# EAGLE design untitled (EAGLE 9.6.2)
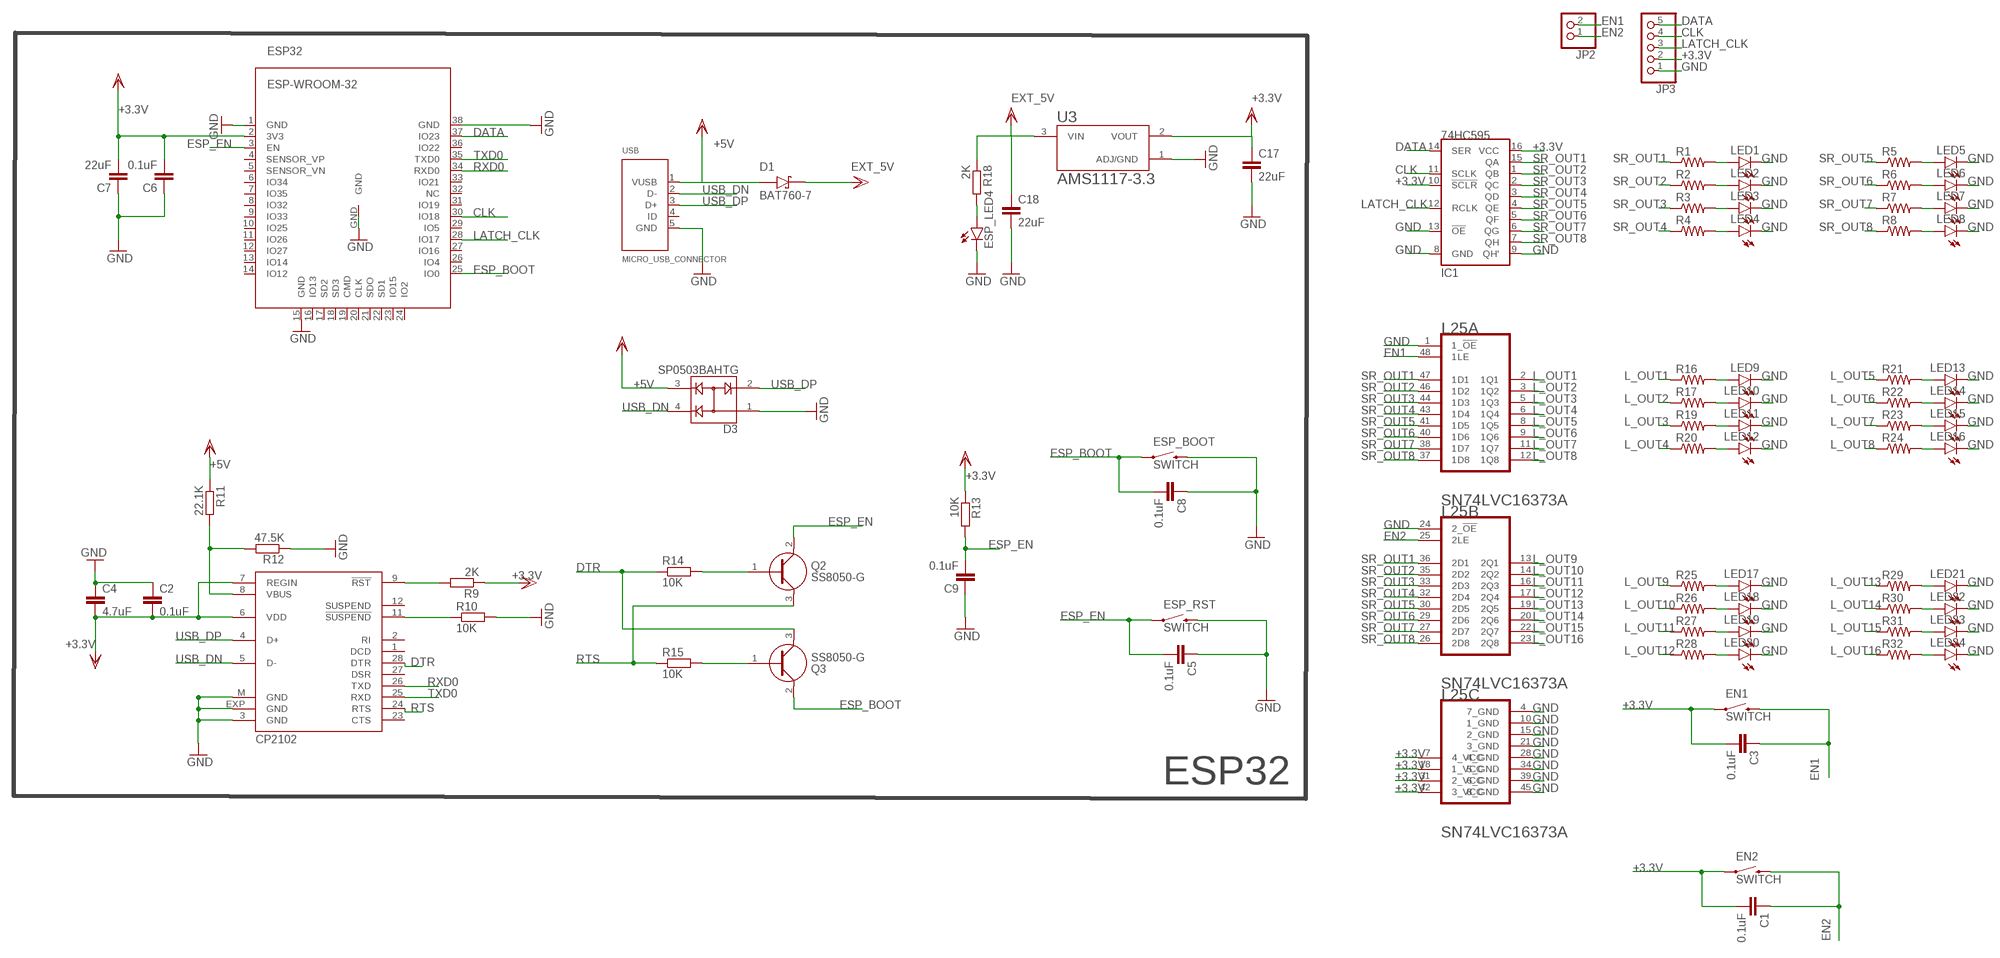
[diagram p0: schematic, sheet 1]

## Parts
C1  0.1uF  C-EUC0805  [C0805]
C2  0.1uF  C-EUC0805  [C0805]
C3  0.1uF  C-EUC0805  [C0805]
C4  4.7uF  C-EUC0805  [C0805]
C5  0.1uF  C-EUC0805  [C0805]
C6  0.1uF  C-EUC0805  [C0805]
C7  22uF  C-EUC0805  [C0805]
C8  0.1uF  C-EUC0805  [C0805]
C9  0.1uF  C-EUC0805  [C0805]
C17  22uF  C-EUC0805  [C0805]
C18  22uF  C-EUC0805  [C0805]
D1  BAT760-7  [SOD2513X120N]
D3  SP0503BAHTG  [SOT143]
EN1  SWITCH  [SWITCH_2PIN]
EN2  SWITCH  [SWITCH_2PIN]
ESP32  ESP-WROOM-32  [ESP-WROOM-32]
ESP_BOOT  SWITCH  [SWITCH_2PIN]
ESP_LED4  LEDCHIPLED_0805  [CHIPLED_0805]
ESP_RST  SWITCH  [SWITCH_2PIN]
IC1  74HC595  [SO16]
IC3  CP2102  [MLP28]
JP2  PINHD-1X2  [1X02]
JP3  PINHD-1X5  [1X05]
L25  TEXAS_INSTRUMENTS_SN74LVC16373ATEXAS_INSTRUMENTS_SN74LVC16373A_0_2  [TEXAS_INSTRUMENTS_SN74LVC16373A_2]
LED1  LEDCHIPLED_0805  [CHIPLED_0805]
LED2  LEDCHIPLED_0805  [CHIPLED_0805]
LED3  LEDCHIPLED_0805  [CHIPLED_0805]
LED4  LEDCHIPLED_0805  [CHIPLED_0805]
LED5  LEDCHIPLED_0805  [CHIPLED_0805]
LED6  LEDCHIPLED_0805  [CHIPLED_0805]
LED7  LEDCHIPLED_0805  [CHIPLED_0805]
LED8  LEDCHIPLED_0805  [CHIPLED_0805]
LED9  LEDCHIPLED_0805  [CHIPLED_0805]
LED10  LEDCHIPLED_0805  [CHIPLED_0805]
LED11  LEDCHIPLED_0805  [CHIPLED_0805]
LED12  LEDCHIPLED_0805  [CHIPLED_0805]
LED13  LEDCHIPLED_0805  [CHIPLED_0805]
LED14  LEDCHIPLED_0805  [CHIPLED_0805]
LED15  LEDCHIPLED_0805  [CHIPLED_0805]
LED16  LEDCHIPLED_0805  [CHIPLED_0805]
LED17  LEDCHIPLED_0805  [CHIPLED_0805]
LED18  LEDCHIPLED_0805  [CHIPLED_0805]
LED19  LEDCHIPLED_0805  [CHIPLED_0805]
LED20  LEDCHIPLED_0805  [CHIPLED_0805]
LED21  LEDCHIPLED_0805  [CHIPLED_0805]
LED22  LEDCHIPLED_0805  [CHIPLED_0805]
LED23  LEDCHIPLED_0805  [CHIPLED_0805]
LED24  LEDCHIPLED_0805  [CHIPLED_0805]
Q2  SS8050-G  [MBTB-T-SOT23]
Q3  SS8050-G  [MBTB-T-SOT23]
R1  R-US_R0805  [R0805]
R2  R-US_R0805  [R0805]
R3  R-US_R0805  [R0805]
R4  R-US_R0805  [R0805]
R5  R-US_R0805  [R0805]
R6  R-US_R0805  [R0805]
R7  R-US_R0805  [R0805]
R8  R-US_R0805  [R0805]
R9  2K  R-EU_R0805  [R0805]
R10  10K  R-EU_R0805  [R0805]
R11  22.1K  R-EU_R0805  [R0805]
R12  47.5K  R-EU_R0805  [R0805]
R13  10K  R-EU_R0805  [R0805]
R14  10K  R-EU_R0805  [R0805]
R15  10K  R-EU_R0805  [R0805]
R16  R-US_R0805  [R0805]
R17  R-US_R0805  [R0805]
R18  2K  R-EU_R0805  [R0805]
R19  R-US_R0805  [R0805]
R20  R-US_R0805  [R0805]
R21  R-US_R0805  [R0805]
R22  R-US_R0805  [R0805]
R23  R-US_R0805  [R0805]
R24  R-US_R0805  [R0805]
R25  R-US_R0805  [R0805]
R26  R-US_R0805  [R0805]
R27  R-US_R0805  [R0805]
R28  R-US_R0805  [R0805]
R29  R-US_R0805  [R0805]
R30  R-US_R0805  [R0805]
R31  R-US_R0805  [R0805]
R32  R-US_R0805  [R0805]
U3  AMS1117-3.3  [SOT229P700X180-4N]
USB  MICRO_USB_CONNECTOR  [MICRO_USB_4LEGS]

## Nets
+3.3V: C1.2 C2.2 C3.2 C4.2 C6.2 C7.2 C17.1 EN1.1 EN2.1 ESP32.2(3V3) IC1.10(!SCLR) IC1.16(VCC) IC3.6(VDD) IC3.7(REGIN) JP3.2 L25.7(C:4_VCC) L25.18(C:1_VCC) L25.31(C:2_VCC) L25.42(C:3_VCC) R9.1 R13.1 U3.2(VOUT) ; supply symbol labelled VDD
+5V: D1.A D3.3 R11.1 USB.1(VUSB) ; supply symbol labelled VDD
CLK: ESP32.30(IO18) IC1.11(SCLK) JP3.4
DATA: ESP32.37(IO23) IC1.14(SER) JP3.5
DTR: IC3.28(DTR) Q3.3(C) R14.1
EN1: C3.1 EN1.2 JP2.2 L25.48(A:1LE)
EN2: C1.1 EN2.2 JP2.1 L25.25(B:2LE)
ESP_BOOT: C8.2 ESP32.25(IO0) ESP_BOOT.1 Q3.2(E)
ESP_EN: C5.2 C9.2 ESP32.3(EN) ESP_RST.1 Q2.2(E) R13.2
EXT_5V: C18.1 D1.C(K) R18.1 U3.3(VIN) ; supply symbol labelled VDD
GND: C2.1 C4.1 C5.1 C6.1 C7.1 C8.1 C9.1 C17.2 C18.2 D3.1 ESP32.1(GND) ESP32.15(GND) ESP32.38(GND) ESP32.GND ESP_BOOT.2 ESP_LED4.C ESP_RST.2 IC1.8(GND) IC1.9(QH') IC1.13(!OE) IC3.3(GND) IC3.EXP(GND) IC3.M(GND) JP3.1 L25.1(A:1_!OE!) L25.4(C:7_GND) L25.10(C:1_GND) L25.15(C:2_GND) L25.21(C:3_GND) L25.24(B:2_!OE!) L25.28(C:4_GND) L25.34(C:5_GND) L25.39(C:6_GND) L25.45(C:8_GND) LED1.C LED2.C LED3.C LED4.C LED5.C LED6.C LED7.C LED8.C LED9.C LED10.C LED11.C LED12.C LED13.C LED14.C LED15.C LED16.C LED17.C LED18.C LED19.C LED20.C LED21.C LED22.C LED23.C LED24.C R10.2 R12.1 U3.1(ADJ/GND) USB.5(GND)
L_OUT1: L25.2(A:1Q1) R16.1
L_OUT2: L25.3(A:1Q2) R17.1
L_OUT3: L25.5(A:1Q3) R19.1
L_OUT4: L25.6(A:1Q4) R20.1
L_OUT5: L25.8(A:1Q5) R21.1
L_OUT6: L25.9(A:1Q6) R22.1
L_OUT7: L25.11(A:1Q7) R23.1
L_OUT8: L25.12(A:1Q8) R24.1
L_OUT9: L25.13(B:2Q1) R25.1
L_OUT10: L25.14(B:2Q2) R26.1
L_OUT11: L25.16(B:2Q3) R27.1
L_OUT12: L25.17(B:2Q4) R28.1
L_OUT13: L25.19(B:2Q5) R29.1
L_OUT14: L25.20(B:2Q6) R30.1
L_OUT15: L25.22(B:2Q7) R31.1
L_OUT16: L25.23(B:2Q8) R32.1
LATCH_CLK: ESP32.28(IO17) IC1.12(RCLK) JP3.3
N$1: LED1.A R1.2
N$2: LED2.A R2.2
N$3: LED3.A R3.2
N$4: LED4.A R4.2
N$5: LED5.A R5.2
N$6: LED6.A R6.2
N$7: IC3.11(!SUSPEND) R10.1
N$8: IC3.8(VBUS) R11.2 R12.2
N$9: Q2.1(B) R14.2
N$10: Q3.1(B) R15.2
N$11: LED7.A R7.2
N$12: LED8.A R8.2
N$13: ESP_LED4.A R18.2
N$14: LED9.A R16.2
N$15: LED10.A R17.2
N$16: LED11.A R19.2
N$17: LED12.A R20.2
N$18: LED13.A R21.2
N$19: IC3.9(!RST) R9.2
N$20: LED14.A R22.2
N$21: LED15.A R23.2
N$22: LED16.A R24.2
N$23: LED17.A R25.2
N$24: LED18.A R26.2
N$25: LED19.A R27.2
N$26: LED20.A R28.2
N$27: LED21.A R29.2
N$28: LED22.A R30.2
N$29: LED23.A R31.2
N$30: LED24.A R32.2
RTS: IC3.24(RTS) Q2.3(C) R15.1
RXD0: ESP32.34(RXD0) IC3.26(TXD)
SR_OUT1: IC1.15(QA) L25.36(B:2D1) L25.47(A:1D1) R1.1
SR_OUT2: IC1.1(QB) L25.35(B:2D2) L25.46(A:1D2) R2.1
SR_OUT3: IC1.2(QC) L25.33(B:2D3) L25.44(A:1D3) R3.1
SR_OUT4: IC1.3(QD) L25.32(B:2D4) L25.43(A:1D4) R4.1
SR_OUT5: IC1.4(QE) L25.30(B:2D5) L25.41(A:1D5) R5.1
SR_OUT6: IC1.5(QF) L25.29(B:2D6) L25.40(A:1D6) R6.1
SR_OUT7: IC1.6(QG) L25.27(B:2D7) L25.38(A:1D7) R7.1
SR_OUT8: IC1.7(QH) L25.26(B:2D8) L25.37(A:1D8) R8.1
TXD0: ESP32.35(TXD0) IC3.25(RXD)
USB_DN: D3.4 IC3.5(D-) USB.2(D-)
USB_DP: D3.2 IC3.4(D+) USB.3(D+)
Unconnected: ESP32.4(SENSOR_VP) ESP32.5(SENSOR_VN) ESP32.6(IO34) ESP32.7(IO35) ESP32.8(IO32) ESP32.9(IO33) ESP32.10(IO25) ESP32.11(IO26) ESP32.12(IO27) ESP32.13(IO14) ESP32.14(IO12) ESP32.16(IO13) ESP32.17(SD2) ESP32.18(SD3) ESP32.19(CMD) ESP32.20(CLK) ESP32.21(SDO) ESP32.22(SD1) ESP32.23(IO15) ESP32.24(IO2) ESP32.26(IO4) ESP32.27(IO16) ESP32.29(IO5) ESP32.31(IO19) ESP32.32(NC) ESP32.33(IO21) ESP32.36(IO22) IC3.1(DCD) IC3.2(RI) IC3.12(SUSPEND) IC3.23(CTS) IC3.27(DSR) USB.4(ID)

## Notes on the sheet
- ESP32

## Library data of the parts
C1-C9 C17 C18 = rcl:C-EU: CAPACITOR, European symbol
D1 = BAT760-7:BAT760-7: Diode Schottky 30V 1A Surface Mount SOD-323 Check prices <https://pricing.snapeda.com/parts/BAT760-7/Diodes%20Zetex/view-part?ref=eda>; AVAILABILITY: In Stock; DESCRIPTION: Diode Schottky 30V 1A 2-Pin SOD-323 T/R; MF: Diodes Zetex; MP: BAT760-7; PACKAGE: None; PRICE: None
D3 = SP0503BAHTG:SP0503BAHTG: TVS DIODE 5.5VWM 8.5VC SOT143 Check prices <https://pricing.snapeda.com/parts/SP0503BAHTG/Littelfuse%20Inc./view-part?ref=eda>; AVAILABILITY: In Stock; DESCRIPTION: 8.5V Clamp Ipp Tvs Diode Surface Mount SOT-143-4; MF: Littelfuse Inc.; MP: SP0503BAHTG; PACKAGE: SOT-143 Littelfuse; PRICE: None; PURCHASE-URL: https://pricing.snapeda.com/search/part/SP0503BAHTG/?ref=eda
EN1 EN2 ESP_BOOT ESP_RST = all_in_one:SWITCH
ESP32 = esp32:ESP-WROOM-32
ESP_LED4 LED1-LED24 = led:LED: LED OSRAM: - CHIPLED LG R971, LG N971, LY N971, LG Q971, LY Q971, LO R971, LY R971 LH N974, LH R974 LS Q976, LO Q976, LY Q976 LO Q996 - Hyper CHIPLED LW Q18S LB Q993, LB Q99A, LB R99A - SideLED LS A670, LO A670, LY A670, LG A670, LP A670 LB A673, LV A673, LT A673, LW A673 LH A674 LY A675 LS A676, LA A676, LO A676, LY A676, LW A676 LS A679, LY A679, LG A679 - Hyper Micro SIDELED® LS Y876, LA Y876, LO Y876, LY Y876 LT Y87S - SmartLED LW L88C, LW L88S LB L89C, LB L89S, LG L890 LS L89K, LO L89K, LY L89K LS L896, LA L896, LO L896, LY L896 - TOPLED LS T670, LO T670, LY T670, LG T670, LP T670 LSG T670, LSP T670, LSY T670, LOP T670, LYG T670 LG T671, LOG T671, LSG T671 LB T673, LV T673, LT T673, LW T673 LH T674 LS T676, LA T676, LO T676, LY T676, LB T676, LH T676, LSB T676, LW T676 LB T67C, LV T67C, LT T67C, LS T67K, LO T67K, LY T67K, LW E67C LS E67B, LA E67B, LO E67B, LY E67B, LB E67C, LV E67C, LT E67C LW T67C LS T679, LY T679, LG T679 LS T770, LO T770, LY T770, LG T770, LP T770 LB T773, LV T773, LT T773, LW T773 LH T774 LS E675, LA E675, LY E675, LS T675 LS T776, LA T776, LO T776, LY T776, LB T776 LHGB T686 LT T68C, LB T68C - Hyper Mini TOPLED® LB M676 - Mini TOPLED Santana® LG M470 LS M47K, LO M47K, LY M47K Source: http://www.osram.convergy.de LUXEON: - LUMILED® LXK2-PW12-R00, LXK2-PW12-S00, LXK2-PW14-U00, LXK2-PW14-V00 LXK2-PM12-R00, LXK2-PM12-S00, LXK2-PM14-U00 LXK2-PE12-Q00, LXK2-PE12-R00, LXK2-PE12-S00, LXK2-PE14-T00, LXK2-PE14-U00 LXK2-PB12-K00, LXK2-PB12-L00, LXK2-PB12-M00, LXK2-PB14-N00, LXK2-PB14-P00, LXK2-PB14-Q00 LXK2-PR12-L00, LXK2-PR12-M00, LXK2-PR14-Q00, LXK2-PR14-R00 LXK2-PD12-Q00, LXK2-PD12-R00, LXK2-PD12-S00 LXK2-PH12-R00, LXK2-PH12-S00 LXK2-PL12-P00, LXK2-PL12-Q00, LXK2-PL12-R00 Source: www.luxeon.com KINGBRIGHT: KA-3528ASYC Source: www.kingbright.com
IC1 = 74HC595:74HC595: 8-bit SHIFT REGISTER, output latch Check availability <https://pricing.snapeda.com/parts/74HC595/Nexperia/view-part?ref=eda>; AVAILABILITY: In Stock; CHECK_PRICES: https://www.snapeda.com/parts/74HC595/Nexperia/view-part/?ref=eda; DESCRIPTION: Shift Register Single 8-Bit Serial to Serial/Parallel 16-Pin SSOP T/R; MF: Nexperia; MP: 74HC595; PACKAGE: None; PRICE: None; SNAPEDA_LINK: https://www.snapeda.com/parts/74HC595/Nexperia/view-part/?ref=snap
IC3 = silabs:CP210*: Single-Chip USB to UART Bridge Source: www.silabs.com .. CP2101.pdf / cp2102.pdf; MF: FARNELL; MPN: CP2102-GM; OC_FARNELL: 9282130; OC_NEWARK: 30K5635
JP2 = pinhead:PINHD-1X2: PIN HEADER
JP3 = pinhead:PINHD-1X5: PIN HEADER
L25 = SN74LVC16373A(NEW_16BIT_LATCH):TEXAS_INSTRUMENTS_SN74LVC16373A: TI-SN54_74XXXXX16X373X-48; 3_STATE_OUTPUT: Yes; BITS: 16; CIIVA_IDS: 19307467; CODE__JEDEC: MO-153; DATASHEET_VERSION: SCAS755B; FOOTPRINT_VARIANT_NAME_0: Level C; FOOTPRINT_VARIANT_NAME_1: Level B; FOOTPRINT_VARIANT_NAME_2: Level A; F__NOM_VOLTAGEMAXMHZ: 100; ICC__NOM_VOLTAGEMAXMA: 0.02; IMPORTED: yes; IMPORTED_FROM: vault; IMPORT_TS: 1521844253; INPUT_TYPE: CMOS,TTL; LOGIC: true; MF: Texas Instruments; MPN: SN74LVC16373A; OPERATING_TEMPERATURE_RANGEC: -40 to 125,-40 to 85; OUTPUT_DRIVE_IOLIOHMAXMA: 24/-24; OUTPUT_LOGIC: Non-inverted; OUTPUT_TYPE: CMOS; PACKAGE: DGG0048A; PREFIX: U; RATING: Catalog; RELEASE_DATE: 1459328133; SCHMITT_TRIGGER: No; STATIC_CURRENT: 0.02; TECHNOLOGY_FAMILY: LVC; TPD__NOM_VOLTAGEMAXNS: 6.4,4.2,4.9; VAULT_GUID: 00FB3570-8383-4C82-A038-A58A20934C8C; VAULT_REVISION: B0EE8CD6-9ACA-4FFF-ACFC-C0240CF4C59E; VCC_MAX_V: 3.6; VCC_MIN_V: 1.65; VOLTAGE_NOM_V: 1.8,2.5,2.7,3.3
Q2 Q3 = SS8050-G:SS8050-G: Bipolar Transistors - BJT NPN TRANSISTOR 1.5A 40V Source: Datasheet <https://componentsearchengine.com/Datasheets/1/SS8050-G.pdf> Check prices <https://pricing.snapeda.com/parts/SS8050-G/Comchip%20Technology/view-part?ref=eda>; AVAILABILITY: In Stock; DESCRIPTION: Bipolar (BJT) Transistor NPN 25V 1.5A 100MHz 300mW Surface Mount SOT-23-3; MF: Comchip Technology; MP: SS8050-G; PACKAGE: TO-236 Comchip; PRICE: None; PURCHASE-URL: https://pricing.snapeda.com/search/part/SS8050-G/?ref=eda
R1-R8 R16 R17 R19-R32 = rcl:R-US_: RESISTOR, American symbol; SPICEPREFIX: R
R9-R15 R18 = rcl:R-EU_: RESISTOR, European symbol
U3 = AMS1117-3.3:AMS1117-3.3: Sot223/Pkg 1-Amp 3.3-Volt Low Drop Out Voltage Regulatator Check prices <https://pricing.snapeda.com/parts/AMS1117-3.3/Advanced%20Monolithic%20Systems/view-part?ref=eda>; AVAILABILITY: Not in stock; DESCRIPTION: LDO Voltage Regulators 800MA LDO LINEAR REG; MF: Advanced Monolithic Systems; MP: AMS1117-3.3; PACKAGE: SOT-89 ams; PRICE: None
USB = all_in_one1:MICRO_USB_CONNECTOR

## Board
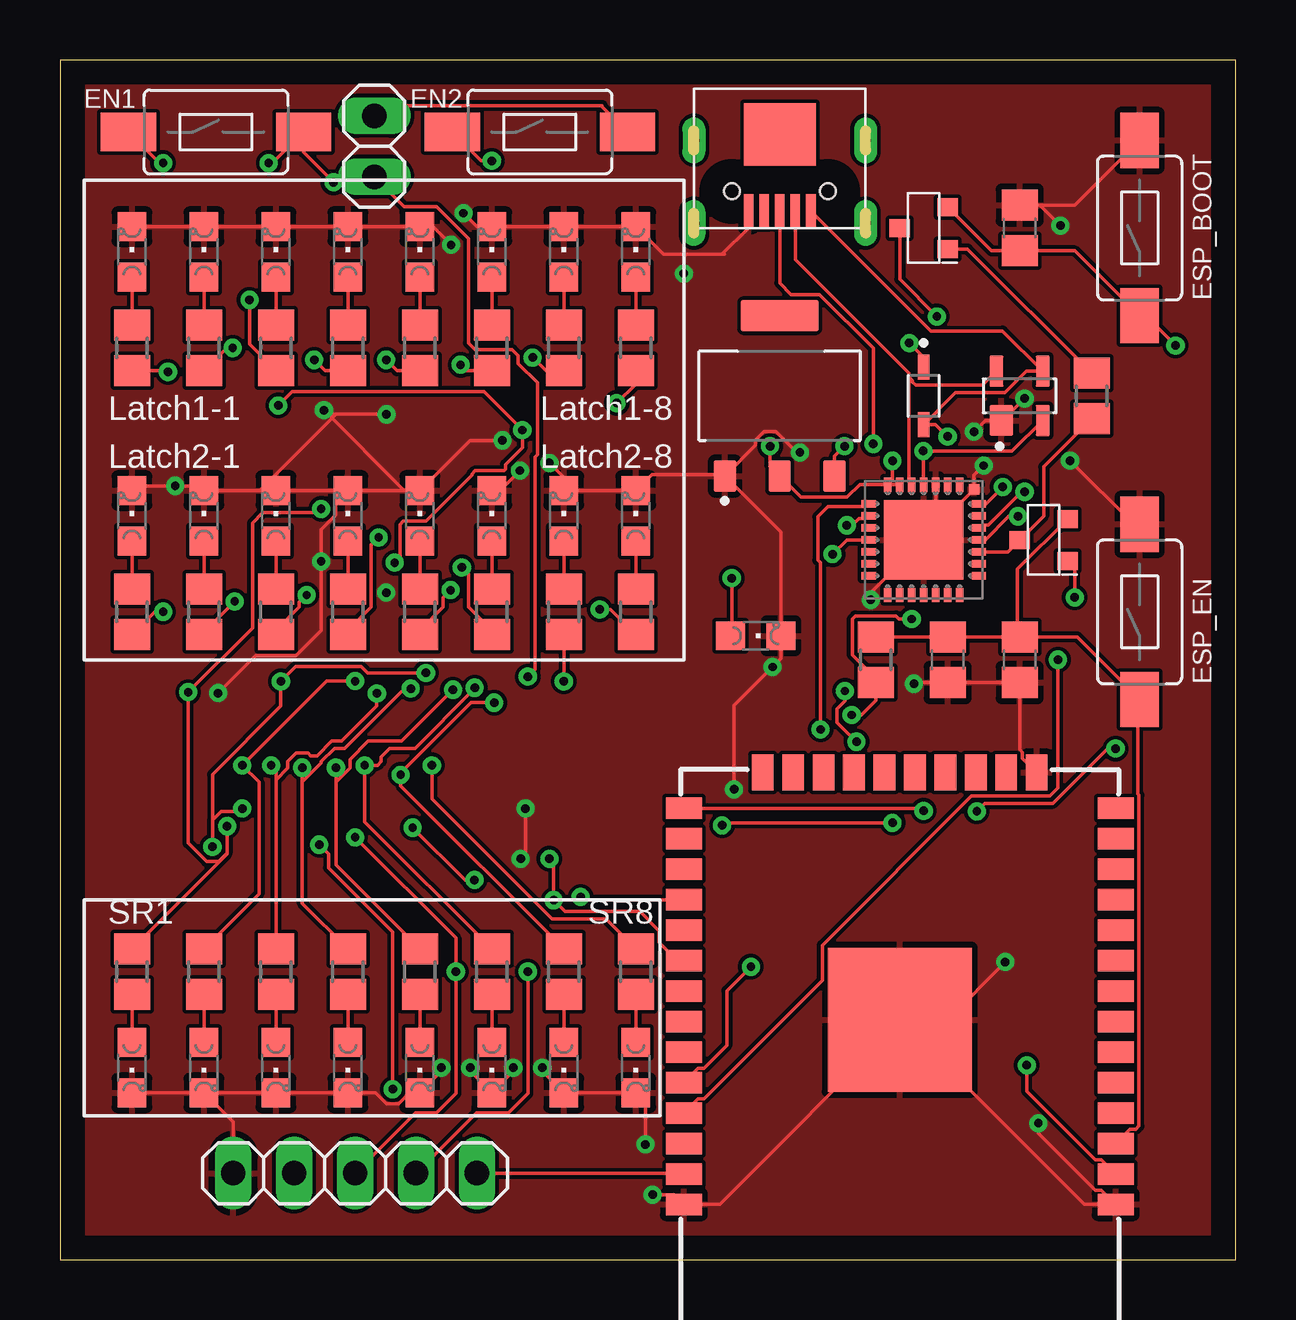
[diagram p1: board, top side]
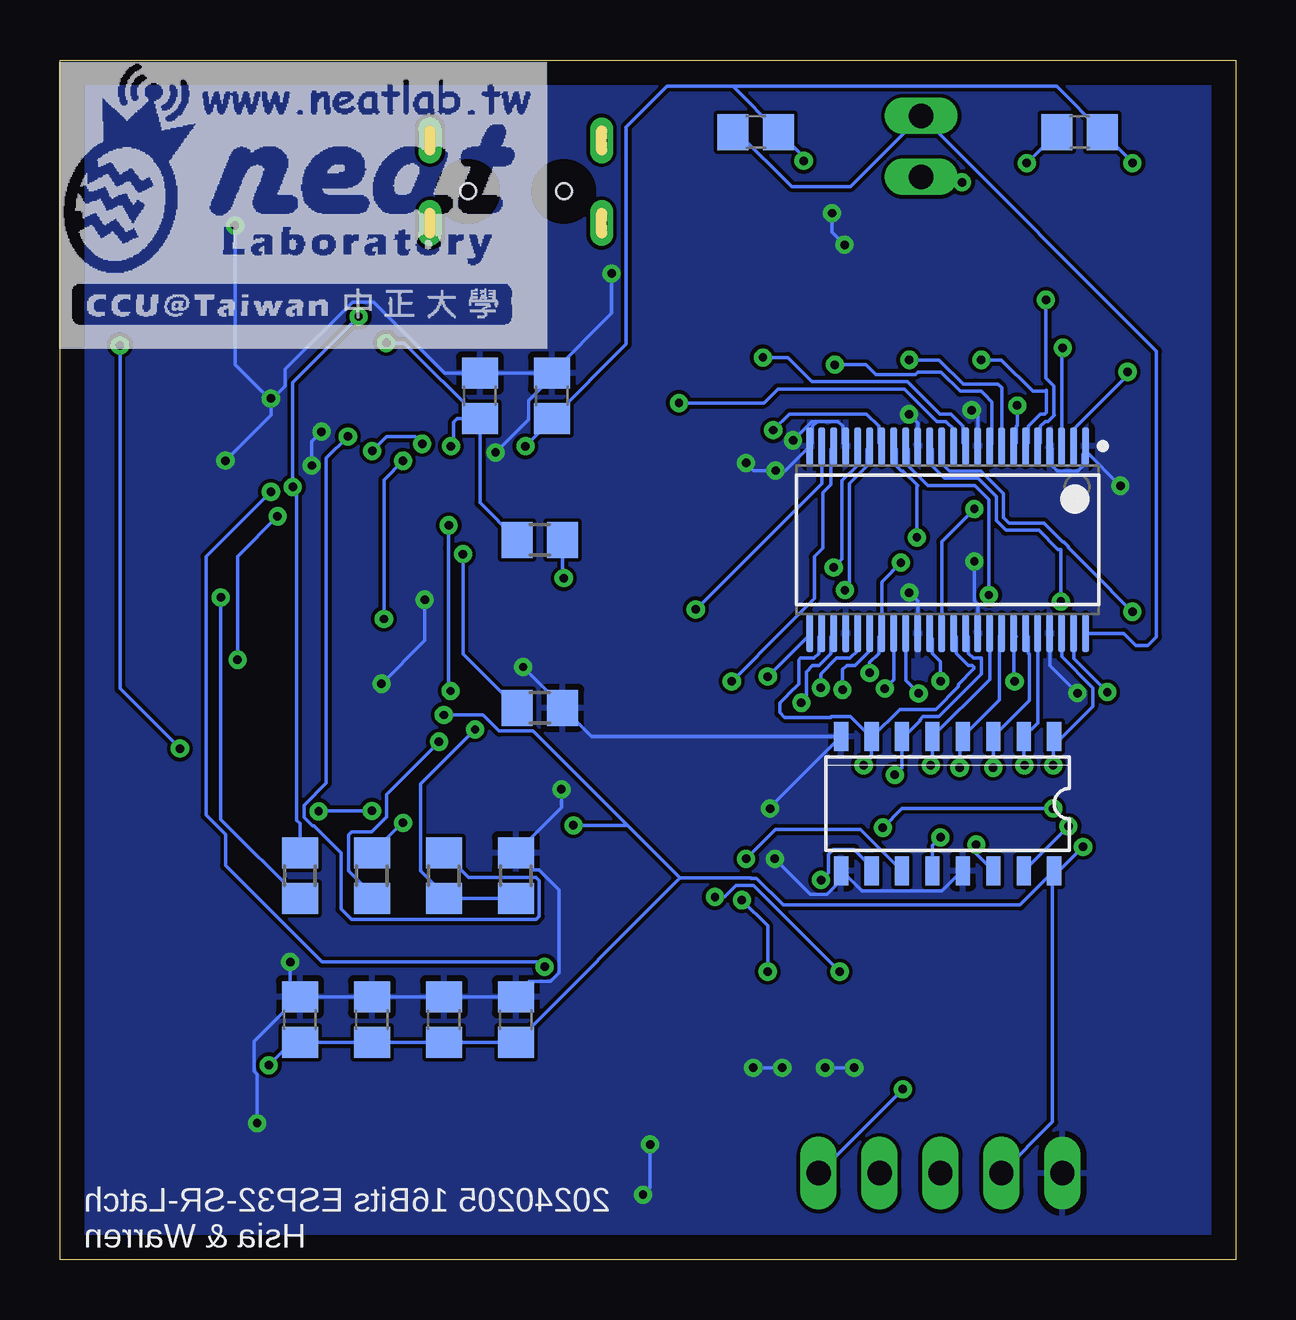
[diagram p2: board, bottom side, seen from below]

Size 49 x 50 mm. Coordinates in mm from the lower left corner, seen from the top.
Outline: 0,0 49,0 49,50 0,50 0,0
Copper layers (1*16): Top 0.035mm / dielectric 1.5mm / Bottom 0.035mm
Design rules "default": minimum track width 6mil, minimum drill 0.35mm, track to track 6mil, track to pad 6mil, pad to pad 6mil, via to via 6mil, smd to smd 6mil, copper to edge 40mil, drill to drill 6mil, minimum pad ring 10mil, minimum via ring 8mil, stop-mask expansion 4mil, vias tented up to drill 0mil, thermal gap 10mil

### Footprints (pad centres in the part's own frame; a part is rotated, then mirrored left to right if it is on the bottom)
C0805 = smd 1.3 x 1.5: 1 -0.95,0; 2 0.95,0
SOD2513X120N = smd 1.04 x 0.46: A 1.19,0; C -1.19,0
SOT143 = smd 0.99 x 1.3: 1 -0.76,-1.025 | smd 0.59 x 1.3: 2 0.96,-1.025; 3 0.96,1.025; 4 -0.96,1.025
SWITCH_2PIN = smd 2.3 x 1.6: 1 -3.65,0; 2 3.65,0
ESP-WROOM-32 = smd 0.9 x 1.5: 1 7.7,9; 2 6.43,9; 3 5.16,9; 4 3.89,9; 5 2.62,9; 6 1.35,9; 7 0.08,9; 8 -1.19,9; 9 -2.46,9; 10 -3.73,9; 11 -5,9; 12 -6.27,9; 13 -7.54,9; 14 -8.81,9; 25 -8.81,-9; 26 -7.54,-9; 27 -6.27,-9; 28 -5,-9; 29 -3.73,-9; 30 -2.46,-9; 31 -1.19,-9; 32 0.08,-9; 33 1.35,-9; 34 2.62,-9; 35 3.89,-9; 36 5.16,-9; 37 6.43,-9; 38 7.7,-9 | smd 1.5 x 0.9: 15 -10.3,5.715; 16 -10.3,4.445; 17 -10.3,3.175; 18 -10.3,1.905; 19 -10.3,0.635; 20 -10.3,-0.635; 21 -10.3,-1.905; 22 -10.3,-3.175; 23 -10.3,-4.445; 24 -10.3,-5.715 | smd 6 x 6: GND 0,0
CHIPLED_0805 = smd 1.2 x 1.2: A 0,-1.05; C 0,1.05
SO16 = smd 0.6 x 1.2: 1 -4.445,-2.8; 2 -3.175,-2.8; 3 -1.905,-2.8; 4 -0.635,-2.8; 5 0.635,-2.8; 6 1.905,-2.8; 7 3.175,-2.8; 8 4.445,-2.8; 9 4.445,2.8; 10 3.175,2.8; 11 1.905,2.8; 12 0.635,2.8; 13 -0.635,2.8; 14 -1.905,2.8; 15 -3.175,2.8; 16 -4.445,2.8
MLP28 = smd 0.6 x 0.3: 1 -2.3,1.5; 2 -2.3,1; 3 -2.3,0.5; 4 -2.3,0; 5 -2.3,-0.5; 6 -2.3,-1; 7 -2.3,-1.5; 15 2.3,-1.5; 16 2.3,-1; 17 2.3,-0.5; 18 2.3,0; 19 2.3,0.5; 20 2.3,1; 21 2.3,1.5 | smd 0.3 x 0.6: 8 -1.5,-2.3; 9 -1,-2.3; 10 -0.5,-2.3; 11 0,-2.3; 12 0.5,-2.3; 13 1,-2.3; 14 1.5,-2.3; 22 1.5,2.3; 23 1,2.3; 24 0.5,2.3; 25 0,2.3; 26 -0.5,2.3; 27 -1,2.3; 28 -1.5,2.3 | smd 3.3 x 3.3: EXP 0,0 | smd 0.435 x 0.435: M -2.103,2.103
1X02 = drill 1.016 long: 1 -1.27,0; 2 1.27,0
1X05 = drill 1.016 long: 1 -5.08,0; 2 -2.54,0; 3 0,0; 4 2.54,0; 5 5.08,0
TEXAS_INSTRUMENTS_SN74LVC16373A_2 = smd 1.6 x 0.3: 1 -3.9,5.75; 2 -3.9,5.25; 3 -3.9,4.75; 4 -3.9,4.25; 5 -3.9,3.75; 6 -3.9,3.25; 7 -3.9,2.75; 8 -3.9,2.25; 9 -3.9,1.75; 10 -3.9,1.25; 11 -3.9,0.75; 12 -3.9,0.25; 13 -3.9,-0.25; 14 -3.9,-0.75; 15 -3.9,-1.25; 16 -3.9,-1.75; 17 -3.9,-2.25; 18 -3.9,-2.75; 19 -3.9,-3.25; 20 -3.9,-3.75; 21 -3.9,-4.25; 22 -3.9,-4.75; 23 -3.9,-5.25; 24 -3.9,-5.75; 25 3.9,-5.75; 26 3.9,-5.25; 27 3.9,-4.75; 28 3.9,-4.25; 29 3.9,-3.75; 30 3.9,-3.25; 31 3.9,-2.75; 32 3.9,-2.25; 33 3.9,-1.75; 34 3.9,-1.25; 35 3.9,-0.75; 36 3.9,-0.25; 37 3.9,0.25; 38 3.9,0.75; 39 3.9,1.25; 40 3.9,1.75; 41 3.9,2.25; 42 3.9,2.75; 43 3.9,3.25; 44 3.9,3.75; 45 3.9,4.25; 46 3.9,4.75; 47 3.9,5.25; 48 3.9,5.75
MBTB-T-SOT23 = smd 0.85 x 0.75: 1 -1,0.875; 2 -1,-0.875; 3 1,0
R0805 = smd 1.3 x 1.5: 1 -0.95,0; 2 0.95,0
SOT229P700X180-4N = smd 0.93 x 1.31: 1 -2.29,-3.345; 2 0,-3.345; 3 2.29,-3.345 | smd 3.24 x 1.31: 4 0,3.345
MICRO_USB_4LEGS = smd 0.4 x 1.4: 1 -1.3,-0.7; 2 -0.65,-0.7; 3 0,-0.7; 4 0.65,-0.7; 5 1.3,-0.7 | smd 3 x 2.6: 6 0,-3.9 | drill 0.45 long: P$1 3.575,-0.2; P$2 3.575,-3.65; P$3 -3.575,-3.65; P$4 -3.575,-0.2 | hole 0.65: -2,-1.525; 2,-1.525

### Placement (x,y rotation side)
C1  6.5,47 0 bottom
C2  36,10 270 bottom
C3  20,47 0 bottom
C4  39,10 270 bottom
C5  37,25 90 top
C6  30,10 270 bottom
C7  33,10 270 bottom
C8  40,43 270 top
C9  40,25 90 top
C17  28.5,36 90 bottom
C18  31.5,36 90 bottom
D1  36,36 270 top
D3  40,36 0 top
EN1  20,47 0 top
EN2  6.5,47 0 top
ESP32  35,10 270 top
ESP_BOOT  45,43 90 top
ESP_LED4  29,26 270 top
ESP_RST  45,27 90 top
IC1  12,19 180 bottom
IC3  36,30 270 top
JP2  13.1,46.4 90 top
JP3  12.3,3.6 0 top
L25  12,30 270 bottom
LED1  3,8 180 top
LED2  6,8 180 top
LED3  9,8 180 top
LED4  12,8 180 top
LED5  15,8 180 top
LED6  18,8 180 top
LED7  21,8 180 top
LED8  24,8 180 top
LED9  3,42 0 top
LED10  6,42 0 top
LED11  9,42 0 top
LED12  12,42 0 top
LED13  15,42 0 top
LED14  18,42 0 top
LED15  21,42 0 top
LED16  24,42 0 top
LED17  3,31 0 top
LED18  6,31 0 top
LED19  9,31 0 top
LED20  12,31 0 top
LED21  15,31 0 top
LED22  18,31 0 top
LED23  21,31 0 top
LED24  24,31 0 top
Q2  41,30 180 top
Q3  36,43 180 top
R1  3,12 270 top
R2  6,12 270 top
R3  9,12 270 top
R4  12,12 270 top
R5  15,12 270 top
R6  18,12 270 top
R7  21,12 270 top
R8  24,12 270 top
R9  36,16 270 bottom
R10  29,23 0 bottom
R11  33,16 270 bottom
R12  30,16 270 bottom
R13  34,25 90 top
R14  39,16 270 bottom
R15  43,36 90 top
R16  3,38 90 top
R17  6,38 90 top
R18  29,30 0 bottom
R19  9,38 90 top
R20  12,38 90 top
R21  15,38 90 top
R22  18,38 90 top
R23  21,38 90 top
R24  24,38 90 top
R25  3,27 90 top
R26  6,27 90 top
R27  9,27 90 top
R28  12,27 90 top
R29  15,27 90 top
R30  18,27 90 top
R31  21,27 90 top
R32  24,27 90 top
U3  30,36 0 top
U$1  [LOGO_SCALE_2.0]  49,38 0 bottom
USB  30,43 180 top

### Tracks (layer width: path | path; a pad name or v marks a point on that pad's centre or on a via)
+3.3V  (via drill 0.35)
  Top 0.152: v29.6,33.9 29.6,33.05 U3.2 30.88,31.77 32.81,31.77 33.34,32.3 IC3.7 | ESP32.2 43.41,4.16 43.16,4.16 40.3,7.02 v40.3,8.1 | v18,45.8 17.55,45.8 EN1.1 | EN2.1 4.15,45.7 v4.3,45.7 | v9.1,35.6 9.67,36.17 17.67,36.17 v19.27,34.57 | v13.95,29.05 14.17,29.27 14.17,30.64 14.3,30.78 15.25,30.78 17.17,32.7 17.17,32.74 17.3,32.88 18.5,32.88 18.57,32.94 18.57,33.14 19.27,33.84 v19.27,34.57 | 19,34.57 v19.27,34.57 | v33,22.7 33.4,22.7 34,23.3 R13.1 34,24.23 33.02,25.2 33.02,26.7 33.16,26.83 34.84,26.83 34.97,26.7 v35.5,26.7 | IC3.6 IC3.7 | v34.7,18.2 27.7,18.2 v27.6,18.1 | v7.6,18.8 7.47,18.67 6.71,18.67 6.36,18.31 v6.36,17.2 6.36,20.21 9.21,23.07 v9.21,24.1 9.82,24.72 12.55,24.72 12.82,24.45 v15.25,24.45 | v14.7,18 16.88,15.82 v17.28,15.82 | v34.7,33.29 34.7,32.5 IC3.7
  Bottom 0.152: v29.6,33.9 28.5,35 C17.1 25.4,38.15 25.4,47.21 23.7,48.91 20.96,48.91 | v40.3,8.1 39.35,9.05 C4.2 C2.2 C7.2 C6.2 23.15,15.9 | v18,45.8 18,45.95 C3.2 20.96,48.91 | v4.3,45.7 4.3,45.75 C1.2 7.46,48.91 20.96,48.91 | L25.18 14.87,34.02 14.87,34.74 15.38,35.25 18.59,35.25 v19.27,34.57 | L25.7 9.13,34.02 9.13,34.74 9.1,34.77 v9.1,35.6 | v13.95,29.05 14.75,28.25 L25.31 14.87,25.98 14.87,25.26 15.25,24.88 v15.25,24.45 | 9.13,25.98 L25.42 9.25,24.14 v9.21,24.1 | v6.36,17.2 7.36,16.2 IC1.16 7.63,16.13 | 7.63,16.13 8.98,14.77 18.84,14.77 19.96,15.89 20.19,15.89 20.2,15.9 23.15,15.9 | 23.15,15.9 25.35,18.1 | 25.35,18.1 29.27,22.02 30.7,22.02 31.37,22.7 v33,22.7 | JP3.2 7.63,5.73 7.63,16.13 | R9.1 34.75,18.2 v34.7,18.2 | v27.6,18.1 25.35,18.1 | v7.6,18.8 13.9,18.8 v14.7,18 | IC1.10 15.18,16.38 15.9,17.1 16.77,17.1 16.97,16.89 16.97,16.12 v17.28,15.82 | v35.5,26.7 35.5,32.49 v34.7,33.29
+5V  (via drill 0.35)
  Top 0.152: USB.1 36.3,38.7 39.28,38.7 D3.3 40.28,37.02 39.39,36.14 37.33,36.14 D1.A 36.5,34.81 v37,34.31
  Bottom 0.152: v37,34.31 37.9,33.41 37.9,19.86 38.82,18.93 38.82,18.43 38.47,18.08 38.4,18.08 37.28,16.96 37.28,14.61 36.84,14.17 29.16,14.17 29.02,14.3 29.02,15.79 29.16,15.93 31.98,15.93 R11.1
CLK  (via drill 0.35)
  Top 0.152: JP3.4 17.36,6.12 18.7,6.12 19.5,6.93 v19.5,12 | ESP32.30 25.75,12.46 24.98,13.23 24.98,13.7 24.17,14.51 21.05,14.51 v20.58,14.98 20.58,16.52 v20.4,16.7
  Bottom 0.152: v19.5,12 19.5,13.9 v20.58,14.98 | IC1.11 15.63,17.93 19.17,17.93 v20.4,16.7
DATA  (via drill 0.35)
  Top 0.152: JP3.5 25.97,3.6 ESP32.37 | v10.81,17.29 11.2,16.91 11.2,16.32 13.87,13.65 v13.87,7.1
  Bottom 0.152: IC1.14 10.81,16.91 v10.81,17.29 | v13.87,7.1 JP3.5
DTR  (via drill 0.35)
  Top 0.152: Q3.3 35,40.86 v36.55,39.31 | v39.3,32.2 38.6,31.5 IC3.28
  Bottom 0.152: v36.55,39.31 39.3,36.56 v39.3,32.2 39.13,32.03 39.13,18.3 39,18.18 R14.1
EN1
  Top 0.152: EN1.2 22.6,48.05 22.6,48.1 13.53,48.1 JP2.2
  Bottom 0.152: L25.48 4.66,26.1 4.15,25.59 3.65,25.59 3.29,25.95 3.29,37.86 JP2.2 16.05,44.72 18.5,44.72 20.77,47 C3.1
EN2  (via drill 0.35)
  Top 0.152: JP2.1 14.35,43.88 15.7,43.88 17.02,42.55 17.02,38.2 17.3,37.93 18.84,37.93 19.09,37.68 19.09,37.35 19.9,36.54 19.9,33.56 19.79,33.45 19.79,24.59 v19.5,24.3 | v11.4,44.9 10.15,46.15 EN2.2 8.85,45.7 v8.7,45.7
  Bottom 0.152: v19.5,24.3 17.75,26.05 L25.25 | JP2.1 12.87,44.9 v11.4,44.9 | v8.7,45.7 7.45,46.95 C1.1
ESP_BOOT  (via drill 0.35)
  Top 0.152: Q3.2 38.83,42.05 C8.2 42.3,42.05 ESP_BOOT.1 45.25,39.35 v46.5,38.1 | ESP32.25 35.89,18.81 v36,18.7 | v38.22,18.68 38.55,19.02 41.39,19.02 43.67,21.3 v44,21.3
  Bottom 0.152: v36,18.7 38.2,18.7 v38.22,18.68 | v44,21.3 46.5,23.8 v46.5,38.1
ESP_EN
  Top 0.152: R13.2 C5.2 39.9,25.95 | 39.9,25.95 C9.2 42.4,25.95 44.92,23.43 | ESP_RST.1 44.92,23.43 | ESP32.3 44.59,5.43 44.84,5.43 44.98,5.57 44.98,19.36 44.92,19.41 44.92,23.43 | Q2.2 39.9,28.77 39.9,25.95
EXT_5V  (via drill 0.35)
  Top 0.152: U3.3 32.29,33.49 v32.7,33.9 | v35.4,38.2 36,37.6 D1.C
  Bottom 0.152: v32.7,33.9 32.6,34 32.6,34.9 32.45,35.05 C18.1 | C18.1 31.5,31.55 R18.1 | C18.1 34.65,38.2 v35.4,38.2
GND  (via drill 0.35)
  Top 0.152: IC3.3 36.5,30.5 | 36.5,30.5 IC3.EXP 33.8,27.8 v33.8,27.5 | 36.5,30.5 IC3.M 38.1,32.69 v38.51,33.09 | v38.1,34.51 38.57,34.98 D3.1 39.29,34.98 v40.21,35.89 | ESP_RST.2 44.75,30.65 v42.1,33.3 | 26.1,41.9 25.15,41.9 LED16.C LED15.C LED14.C 17.38,43.05 v16.82,43.62 | 26.1,41.9 27.6,41.9 | 27.6,41.9 27.7,41.9 | USB.5 28.7,43 27.6,41.9 | v26.01,41.1 26.01,41.81 26.1,41.9 | ESP_BOOT.2 42.3,43.95 C8.1 40.85,43.95 v41.7,43.1 | v30.84,33.64 30.72,33.64 29.85,34.51 29.35,34.51 28.99,34.15 28.99,33.94 27.78,32.72 | 27.78,32.72 U3.1 30.05,30.32 ESP_LED4.C 30.05,25.05 v29.7,24.7 28.1,23.1 v28.1,19.6 | 27.78,32.72 24.67,32.72 LED24.C LED23.C 21,32.6 v20.4,33.2 | v35.6,24 35.65,24.05 C5.1 C9.1 40,21.27 40.12,21.14 40.12,20.89 ESP32.15 | v39.4,12.4 37,10 ESP32.GND 35.1,9.9 | v40.78,5.68 40.78,5.27 43.16,2.89 43.41,2.89 ESP32.1 42.7,2.3 35.1,9.9 | 35.1,9.9 27.5,2.3 ESP32.38 25.6,2.7 v24.7,2.7 | v24.4,4.8 24.4,6.55 LED8.C LED7.C 20.11,7.84 v20.11,7.99 | LED1.C LED2.C | LED2.C 7.22,5.73 JP3.1 | LED2.C LED3.C LED4.C 13.16,6.95 13.62,6.49 14.12,6.49 14.58,6.95 LED5.C 15.89,7.84 v15.89,7.99 | v17.11,7.99 17.11,7.84 LED6.C 18.89,7.84 v18.89,7.99 | v19.4,18.8 19.4,16.9 v19.2,16.7 | LED20.C LED19.C 8.32,32.05 | LED21.C LED20.C | LED17.C 3.2,32.25 v4.8,32.25 5.8,32.25 LED18.C 8.32,32.05 | v19.17,32.89 18.34,32.05 LED22.C | LED9.C LED10.C LED11.C LED12.C LED13.C 15.55,43.05 v16.3,42.3 | LED21.C 14.35,32.05 v11,35.4 11.17,35.23 11.5,35.23 | v13.61,35.23 11.5,35.23 | 11.5,35.23 8.32,32.05 | v6.59,23.61 8.15,25.17 9.85,25.17 10.89,26.21 v10.89,29.1 10.89,30.43 11.49,31.04 11.49,31.54 LED20.C | LED21.C 17.09,34.14 v18.44,34.14
  Bottom 0.152: v38.51,33.09 38.51,34.1 v38.1,34.51 | v42.1,33.3 40.21,35.19 40.21,35.8 | 40.21,35.8 v40.21,35.89 | C17.2 C18.2 32.97,36.95 35.93,39.91 36.8,39.91 39.6,37.11 39.6,36.4 40.21,35.8 | C17.2 26.01,39.44 v26.01,41.1 | v41.7,43.1 41.7,37.29 40.21,35.8 | v30.84,33.64 29.48,35.01 29.48,35.8 28.5,36.77 C17.2 | v29.7,24.7 28.05,23.05 R10.2 26.85,21.8 IC1.8 19.4,18.84 v19.4,18.8 | v33.8,27.5 33.8,25.8 v35.6,24 | C6.1 30.1,10.95 | 30.1,10.95 C7.1 C2.1 C4.1 39.02,10.97 | 39.02,10.97 39.4,11.35 v39.4,12.4 | v40.78,5.68 40.78,7.72 40.91,7.85 40.91,9.09 39.02,10.97 | v24.4,4.8 24.4,3 v24.7,2.7 | v15.89,7.99 v17.11,7.99 | v18.89,7.99 v20.11,7.99 | IC1.13 11.41,16.2 12.24,15.37 15.57,15.37 16.4,16.2 IC1.9 16.67,15.98 16.67,15.56 17.02,15.21 17.71,15.21 v19.2,16.7 | v28.1,19.6 28.1,18.85 R12.1 29.28,16.23 29.03,16.23 28.19,15.4 28.19,11.95 28.55,11.59 29.46,11.59 30.1,10.95 | v20.4,33.2 20.09,32.89 v19.17,32.89 18.76,32.89 L25.24 17.63,34.02 17.63,34.74 17.44,34.93 | v16.3,42.3 16.82,42.82 v16.82,43.62 | L25.21 16.37,34.02 16.37,34.74 16.56,34.93 17.44,34.93 | 17.44,34.93 17.66,34.93 v18.44,34.14 | L25.10 10.75,35.15 v11,35.4 | L25.15 13.25,34.87 v13.61,35.23 | L25.1 6.25,33.7 | 6.25,33.7 v4.8,32.25 | L25.4 7.63,33.78 7.63,33.06 7.44,32.87 6.56,32.87 6.37,33.06 6.37,33.58 6.25,33.7 | L25.39 10.75,27.31 10.89,27.45 v10.89,29.1 | L25.45 7.75,24.77 v6.59,23.61 | L25.34 13.25,27.45 v13.6,27.8
  pour Bottom: -10,60 -10,-10 60,-10 60,60
  pour Top: -10,60 -10,-10 60,-10 60,60
L_OUT1  (via drill 0.35)
  Top 0.152: R16.1 4.45,37.05 v4.5,37
  Bottom 0.152: v4.5,37 4.5,36.87 6.75,34.62 L25.2
L_OUT2  (via drill 0.35)
  Top 0.152: v7.2,38 6.95,38 R17.1
  Bottom 0.152: v7.2,38 7.25,37.95 L25.3
L_OUT3  (via drill 0.35)
  Top 0.152: v7.9,40 7.9,38.15 R19.1
  Bottom 0.152: L25.5 8.13,34.02 8.13,34.74 7.94,34.93 7.83,34.93 7.55,35.2 7.57,35.21 7.57,36.4 7.9,36.73 v7.9,40
L_OUT4  (via drill 0.35)
  Top 0.152: R20.1 11.05,37.05 v10.6,37.5
  Bottom 0.152: v10.6,37.5 9.76,37.5 8.45,36.19 7.95,36.19 7.89,36.25 7.89,35.29 7.95,35.23 8.13,35.23 8.63,34.74 8.63,34.02 L25.6
L_OUT5  (via drill 0.35)
  Top 0.152: R21.1 14.05,37.05 v13.6,37.5
  Bottom 0.152: v13.6,37.5 12.36,37.5 11.35,36.49 10.85,36.49 10.84,36.5 9.9,36.5 9.75,36.35 L25.8
L_OUT6  (via drill 0.35)
  Top 0.152: R22.1 16.95,37.05 v16.7,37.3
  Bottom 0.152: 10.72,36.19 10.72,36.2 10.6,36.2 10.59,36.19 | v16.7,37.3 15.4,37.3 14.99,36.89 13.35,36.89 13.24,37 12.29,37 11.48,36.19 10.72,36.19 | L25.9 10.15,34 10.15,35.74 10.45,36.05 10.59,36.19 | 10.59,36.19 10.72,36.19
L_OUT7  (via drill 0.35)
  Top 0.152: R23.1 20.25,37.05 v19.7,37.6
  Bottom 0.152: v19.7,37.6 18.66,37.6 17.65,36.59 13.68,36.59 12.32,35.23 11.87,35.23 11.37,34.74 11.37,34.02 L25.11
L_OUT8  (via drill 0.35)
  Top 0.152: R24.1 24,36.5 v23.2,35.7
  Bottom 0.152: v23.2,35.7 19.66,35.7 19.07,36.28 13.8,36.28 12.45,34.93 12.06,34.93 11.75,34.62 L25.12
L_OUT9  (via drill 0.35)
  Top 0.152: R25.1 3.95,27 v4.3,27
  Bottom 0.152: v4.3,27 5.15,27.85 5.2,27.9 6.98,29.68 6.98,29.73 7.15,29.91 7.2,29.91 8,30.7 9.45,30.7 9.67,30.93 9.67,31.93 10.61,32.87 11.94,32.87 12.25,33.19 L25.13
L_OUT10  (via drill 0.35)
  Top 0.152: R26.1 6,26.15 v7.28,27.43
  Bottom 0.152: v7.28,27.43 7.28,29.6 7.4,29.6 8.2,30.4 9.58,30.4 9.98,30.8 9.98,31.81 10.74,32.57 12.13,32.57 12.63,33.06 12.63,33.78 L25.14
L_OUT11  (via drill 0.35)
  Top 0.152: v10.28,27.7 9.98,27.4 9.98,27.2 9,26.23 R27.1
  Bottom 0.152: v10.28,27.7 10.28,31.68 10.86,32.26 12.83,32.26 13.63,33.06 13.63,33.78 L25.16
L_OUT12  (via drill 0.35)
  Top 0.152: v13.28,30.1 12.98,29.8 12.98,27.2 12,26.23 R28.1
  Bottom 0.152: v13.28,30.1 13.28,32.22 13.25,32.25 13.87,32.87 13.94,32.87 14.13,33.06 14.13,33.78 L25.17
L_OUT13  (via drill 0.35)
  Top 0.152: v16.28,27.9 15.98,27.6 15.98,27.2 15,26.23 R29.1
  Bottom 0.152: v16.28,27.9 16.1,28.08 16.1,32.34 15.37,33.06 15.37,33.78 L25.19
L_OUT14  (via drill 0.35)
  Top 0.152: R30.1 18,26.23 17.02,27.2 17.02,28.58 v16.75,28.85
  Bottom 0.152: v16.75,28.85 16.41,29.2 16.41,32.46 15.75,33.12 L25.20
L_OUT15  (via drill 0.35)
  Top 0.152: R31.1 v21,24.1
  Bottom 0.152: v21,24.1 18.8,26.3 17.56,27.54 17.56,29.3 17.2,29.66 17.2,31.97 16.87,32.3 16.87,33.78 L25.22
L_OUT16  (via drill 0.35)
  Top 0.152: R32.1 22.95,27.1 v22.5,27.1
  Bottom 0.152: v22.5,27.1 17.25,32.35 L25.23
LATCH_CLK  (via drill 0.35)
  Top 0.152: JP3.3 14.82,6.12 15.7,6.12 16.5,6.93 16.5,11.9 v16.5,12 16.5,13.4 v12.3,17.6 | v21.7,15.11 21.81,15 ESP32.28
  Bottom 0.152: v21.7,15.11 21.3,15.11 20.83,15.59 20.09,15.59 v16.5,12 | IC1.12 12.63,17.27 v12.3,17.6
N$1
  Top 0.152: R1.2 LED1.A
N$2
  Top 0.152: R2.2 LED2.A
N$3
  Top 0.152: R3.2 LED3.A
N$4
  Top 0.152: R4.2 LED4.A
N$5
  Top 0.152: R5.2 LED5.A
N$6
  Top 0.152: R6.2 LED6.A
N$7  (via drill 0.35)
  Top 0.152: v32.2,29.4 32.8,30 IC3.11
  Bottom 0.152: R10.1 32.2,25.25 v32.2,29.4
N$8  (via drill 0.35)
  Top 0.152: IC3.8 33.58,31.38 32.01,31.38 31.59,30.97 31.59,29.15 31.7,29.04 v31.7,22.09
  Bottom 0.152: R12.2 R11.2 33,15.23 33.98,16.2 33.98,19.82 v31.7,22.09
N$9  (via drill 0.35)
  Top 0.152: v42.3,27.6 42.3,28.82 Q2.1
  Bottom 0.152: R14.2 42.3,18.35 v42.3,27.6
N$10
  Top 0.152: R15.2 37.83,42.12 Q3.1
N$11
  Top 0.152: R7.2 LED7.A
N$12
  Top 0.152: R8.2 LED8.A
N$13  (via drill 0.35)
  Top 0.152: v28,28.4 28,26.05 ESP_LED4.A
  Bottom 0.152: R18.2 28.05,28.45 v28,28.4
N$14
  Top 0.152: LED9.A R16.2
N$15
  Top 0.152: LED10.A R17.2
N$16
  Top 0.152: LED11.A R19.2
N$17
  Top 0.152: LED12.A R20.2
N$18
  Top 0.152: LED13.A R21.2
N$19  (via drill 0.35)
  Top 0.152: IC3.9 33.58,30.88 33.3,30.88 33.03,30.61 v32.8,30.61 | v32.72,23.7 32.72,23.28 32.39,22.95 32.39,22.39 v33.2,21.58
  Bottom 0.152: v32.8,30.61 32.8,29.66 32.81,29.65 32.81,23.79 v32.72,23.7 | v33.2,21.58 35.39,19.39 35.39,18.45 36.01,17.83 36.84,17.83 36.98,17.7 36.98,16.2 36,15.23 R9.2
N$20
  Top 0.152: LED14.A R22.2
N$21
  Top 0.152: LED15.A R23.2
N$22
  Top 0.152: LED16.A R24.2
N$23
  Top 0.152: LED17.A R25.2
N$24
  Top 0.152: LED18.A R26.2
N$25
  Top 0.152: LED19.A R27.2
N$26
  Top 0.152: LED20.A R28.2
N$27
  Top 0.152: LED21.A R29.2
N$28
  Top 0.152: LED22.A R30.2
N$29
  Top 0.152: LED23.A R31.2
N$30
  Top 0.152: R32.2 LED24.A
RTS
  Top 0.152: R15.1 41,33.05 41,31 Q2.3 39.5,29.5 IC3.24
RXD0  (via drill 0.35)
  Top 0.152: IC3.26 38.42,30.62 38.7,30.62 40.07,32 v40.21,32 | v28.8,12.2 27.8,11.2 27.8,8.93 26.84,7.97 26.59,7.97 ESP32.34
  Bottom 0.152: v40.21,32 42.91,29.3 42.91,18.53 42.1,17.72 42.1,16.43 38.07,12.4 29,12.4 v28.8,12.2
SR_OUT1  (via drill 0.35)
  Top 0.152: v10.89,31.29 10.73,31.13 8.46,31.13 8.02,30.7 8.02,26.33 v5.34,23.65 5.34,17.35 6.1,16.59 6.61,16.59 6.96,16.95 v6.96,18.06 6.96,16.91 R1.1
  Bottom 0.152: IC1.15 v6.96,18.06 | L25.47 6.75,25.06 v5.34,23.65 | v10.89,31.29 12.25,29.93 L25.36
SR_OUT2  (via drill 0.35)
  Top 0.152: v12.3,24.11 11.11,24.11 v7.6,20.6 8.3,19.9 8.3,15.25 R2.1
  Bottom 0.152: IC1.1 7.6,21.75 7.6,21.4 | 7.6,21.4 v7.6,20.6 | L25.35 12.75,26 12.63,25.88 12.63,25.26 12.3,24.93 v12.3,24.11 | L25.46 7.25,25.13 5.95,23.83 5.95,23.05 7.6,21.4
SR_OUT3  (via drill 0.35)
  Top 0.152: v8.8,20.6 8.85,20.65 9,20.5 9,20 | R3.1 9,20 | 9,20 9.49,20.49 9.49,20.75 9.85,21.11 10.35,21.11 10.46,21 10.71,21 11.32,21.61 11.74,21.61 13.21,23.07 v13.21,23.6
  Bottom 0.152: L25.44 8.25,22.38 IC1.2 8.82,20.62 v8.8,20.6 | v13.21,23.6 13.75,24.14 L25.33
SR_OUT4  (via drill 0.35)
  Top 0.152: R4.1 10.1,14.85 10.1,19.9 | 10.1,19.9 v10.1,20.5 | 10.1,19.9 10.89,20.69 10.89,20.75 11.44,21.3 11.87,21.3 14.37,23.8 v14.62,23.8
  Bottom 0.152: L25.43 8.63,25.98 8.63,25.26 8.6,25.23 8.6,23.3 IC1.3 v10.1,20.5 | v14.62,23.8 14.25,24.17 L25.32
SR_OUT5  (via drill 0.35)
  Top 0.152: R5.1 11.5,16.45 11.5,19.9 | 11.5,19.9 v11.5,20.5 | 11.5,19.9 12.09,20.49 12.09,20.85 12.85,21.61 14.24,21.61 v16.38,23.75
  Bottom 0.152: L25.41 9.85,26 9.85,23.32 IC1.4 11.5,21.66 v11.5,20.5 | v16.38,23.75 16.38,24.59 16.2,24.77 15.87,24.77 15.25,25.39 L25.30
SR_OUT6  (via drill 0.35)
  Top 0.152: R6.1 12.7,18.25 v12.7,20.6 13.23,20.6 13.39,20.76 13.39,20.95 13.75,21.31 14.79,21.31 15.94,22.46 16.03,22.55 17.29,23.8 v17.29,23.83
  Bottom 0.152: L25.40 10.25,24.18 IC1.5 12.63,20.66 v12.7,20.6 | v17.29,23.83 17.29,24.41 16.63,25.07 16.06,25.07 15.75,25.39 L25.29
SR_OUT7  (via drill 0.35)
  Top 0.152: R7.1 14.2,19.75 v14.2,20.2 14.2,20.28 17.14,23.23 18.08,23.23 v18.1,23.21
  Bottom 0.152: IC1.6 13.9,21.7 | 13.9,21.7 13.9,20.5 v14.2,20.2 | 13.9,21.7 13.16,22.44 13.16,22.5 13.03,22.63 12.37,22.63 10.6,24.4 10.6,25.07 10.94,25.07 11.13,25.26 11.13,25.98 L25.38 | v18.1,23.21 17.89,23.41 17.89,24.5 17.63,24.77 17.37,24.77 16.87,25.26 16.87,25.98 L25.27
SR_OUT8  (via drill 0.35)
  Top 0.152: R8.1 22.75,14.2 20.5,14.2 15.5,19.2 v15.5,20.6
  Bottom 0.152: IC1.7 15.13,21.8 13.99,22.93 12.5,22.93 11.55,23.88 11.55,23.98 10.9,24.63 10.9,24.7 10.97,24.77 11.13,24.77 11.63,25.26 11.63,25.98 L25.37 | v15.5,20.6 15.18,20.93 IC1.7 | L25.26 17.37,25.98 17.37,25.26 17.56,25.07 18.13,25.07 18.2,25 18.2,24 18.61,23.59 18.7,23.5 19,23.2 19,22.8 18.8,22.6 16.87,22.6 16.84,22.63 16.05,22.63 15.22,21.8 IC1.7
TXD0  (via drill 0.35)
  Top 0.152: ESP32.35 26.59,6.7 26.84,6.7 31.77,11.63 31.77,13.1 38,19.32 41.26,19.32 41.6,19.66 v41.6,25 | v39.93,30.98 39.55,30.98 38.57,30 IC3.25
  Bottom 0.152: v41.6,25 41.6,29.31 v39.93,30.98
USB_DN
  Top 0.152: IC3.5 35.38,32.42 35.38,36.8 | USB.2 30.65,41.67 35.38,36.94 35.38,36.8 | 35.38,36.8 35.54,36.64 35.54,36.58 35.67,36.44 38.46,36.44 D3.4
USB_DP  (via drill 0.35)
  Top 0.152: USB.3 30,40.7 30.47,40.23 31.66,40.23 33.9,37.99 v33.9,34 | IC3.4 35.98,32.31 v35.98,33.7 39.69,33.7 D3.2
  Bottom 0.152: v33.9,34 34.2,34.3 35.38,34.3 v35.98,33.7

### Text on the board
tNames: EN1 | EN2 | ESP_BOOT | Latch1-1 | Latch1-8 | Latch2-1 | Latch2-8 | ESP_EN | SR1 | SR8
bNames: 20240205 16Bits ESP32-SR-Latch / Hsia & Warren
201bmp: C:/Users/PW0000/Downloads/未命名.bmp